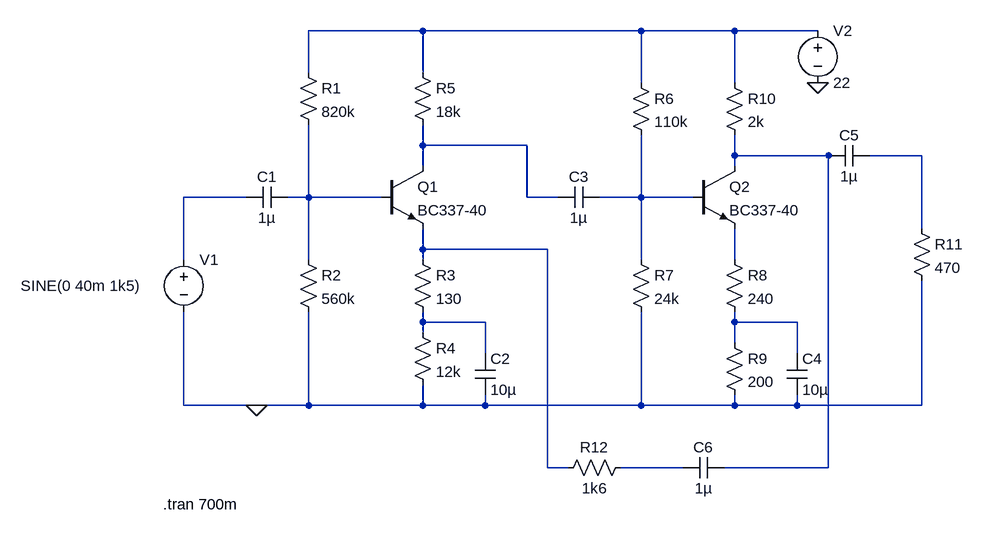
[diagram p0: schematic Amplificador Retro Neg.asc]
Amplificador Retro Neg.asc, the LTspice schematic file:
Version 4.1
SHEET 1 1156 680
WIRE 320 -144 144 -144
WIRE 656 -144 320 -144
WIRE 800 -144 656 -144
WIRE 928 -144 800 -144
WIRE 144 -80 144 -144
WIRE 320 -80 320 -144
WIRE 656 -64 656 -144
WIRE 800 -64 800 -144
WIRE 320 32 320 0
WIRE 480 32 320 32
WIRE 800 48 800 16
WIRE 944 48 800 48
WIRE 1088 48 1008 48
WIRE 320 64 320 32
WIRE 800 64 800 48
WIRE 48 112 -48 112
WIRE 144 112 144 0
WIRE 144 112 112 112
WIRE 256 112 144 112
WIRE 480 112 480 32
WIRE 528 112 480 112
WIRE 656 112 656 16
WIRE 656 112 592 112
WIRE 736 112 656 112
WIRE 1088 160 1088 48
WIRE 320 192 320 160
WIRE 512 192 320 192
WIRE -48 208 -48 112
WIRE 144 208 144 112
WIRE 320 208 320 192
WIRE 656 208 656 112
WIRE 800 208 800 160
WIRE 320 304 320 288
WIRE 416 304 320 304
WIRE 800 304 800 288
WIRE 896 304 800 304
WIRE 320 320 320 304
WIRE 800 336 800 304
WIRE 416 352 416 304
WIRE 896 352 896 304
WIRE -48 432 -48 288
WIRE 64 432 -48 432
WIRE 144 432 144 288
WIRE 144 432 64 432
WIRE 320 432 320 400
WIRE 320 432 144 432
WIRE 416 432 416 416
WIRE 416 432 320 432
WIRE 656 432 656 288
WIRE 656 432 416 432
WIRE 800 432 800 416
WIRE 800 432 656 432
WIRE 896 432 896 416
WIRE 896 432 800 432
WIRE 1088 432 1088 240
WIRE 1088 432 896 432
WIRE 512 528 512 192
WIRE 544 528 512 528
WIRE 720 528 624 528
WIRE 944 528 944 48
WIRE 944 528 784 528
FLAG 64 432 0
FLAG 928 -64 0
SYMBOL voltage -48 192 R0
WINDOW 3 -251 56 Left 2
WINDOW 123 0 0 Left 0
WINDOW 39 0 0 Left 0
SYMATTR Value SINE(0 40m 1k5)
SYMATTR InstName V1
SYMBOL res 128 -96 R0
SYMATTR InstName R1
SYMATTR Value 820k
SYMBOL res 128 192 R0
SYMATTR InstName R2
SYMATTR Value 560k
SYMBOL cap 112 96 R90
WINDOW 0 0 32 VBottom 2
WINDOW 3 32 32 VTop 2
SYMATTR InstName C1
SYMATTR Value 1µ
SYMBOL npn 256 64 R0
SYMATTR InstName Q1
SYMATTR Value BC337-40
SYMBOL res 304 192 R0
SYMATTR InstName R3
SYMATTR Value 130
SYMBOL cap 400 352 R0
SYMATTR InstName C2
SYMATTR Value 10µ
SYMBOL res 304 -96 R0
SYMATTR InstName R5
SYMATTR Value 18k
SYMBOL cap 592 96 R90
WINDOW 0 0 32 VBottom 2
WINDOW 3 32 32 VTop 2
SYMATTR InstName C3
SYMATTR Value 1µ
SYMBOL res 640 -80 R0
SYMATTR InstName R6
SYMATTR Value 110k
SYMBOL res 640 192 R0
SYMATTR InstName R7
SYMATTR Value 24k
SYMBOL npn 736 64 R0
SYMATTR InstName Q2
SYMATTR Value BC337-40
SYMBOL res 784 192 R0
SYMATTR InstName R8
SYMATTR Value 240
SYMBOL res 784 320 R0
SYMATTR InstName R9
SYMATTR Value 200
SYMBOL cap 880 352 R0
SYMATTR InstName C4
SYMATTR Value 10µ
SYMBOL res 784 -80 R0
SYMATTR InstName R10
SYMATTR Value 2k
SYMBOL cap 1008 32 R90
WINDOW 0 0 32 VBottom 2
WINDOW 3 32 32 VTop 2
SYMATTR InstName C5
SYMATTR Value 1µ
SYMBOL res 1072 144 R0
SYMATTR InstName R11
SYMATTR Value 470
SYMBOL cap 784 512 R90
WINDOW 0 0 32 VBottom 2
WINDOW 3 32 32 VTop 2
SYMATTR InstName C6
SYMATTR Value 1µ
SYMBOL res 640 512 R90
WINDOW 0 0 56 VBottom 2
WINDOW 3 32 56 VTop 2
SYMATTR InstName R12
SYMATTR Value 1k6
SYMBOL res 304 304 R0
SYMATTR InstName R4
SYMATTR Value 12k
SYMBOL voltage 928 -160 R0
WINDOW 123 0 0 Left 0
WINDOW 39 0 0 Left 0
SYMATTR InstName V2
SYMATTR Value 22
TEXT -80 584 Left 2 !.tran 700m

The netlist it stands for:
* Amplificador Retro Neg.asc
V1 N005 0 SINE(0 40m 1k5)
R1 N001 N006 820k
R2 N006 0 560k
C1 N006 N005 1µ
Q1 N002 N006 N008 0 BC337-40
R3 N008 N010 130
C2 N010 0 10µ
R5 N001 N002 18k
C3 N007 N002 1µ
R6 N001 N007 110k
R7 N007 0 24k
Q2 N003 N007 N009 0 BC337-40
R8 N009 N011 240
R9 N011 0 200
C4 N011 0 10µ
R10 N001 N003 2k
C5 N004 N003 1µ
R11 N004 0 470
C6 N003 N012 1µ
R12 N012 N008 1k6
R4 N010 0 12k
V2 N001 0 22
.model NPN NPN
.model PNP PNP
.lib standard.bjt
.tran 700m
.backanno
.end